# Altium schematic sheet RS485.SchDoc: Comunicación RS-485
size A4; Author: Agustin Zuliani; Revision: Rev: 00; SheetNumber: 2; SheetTotal: 7
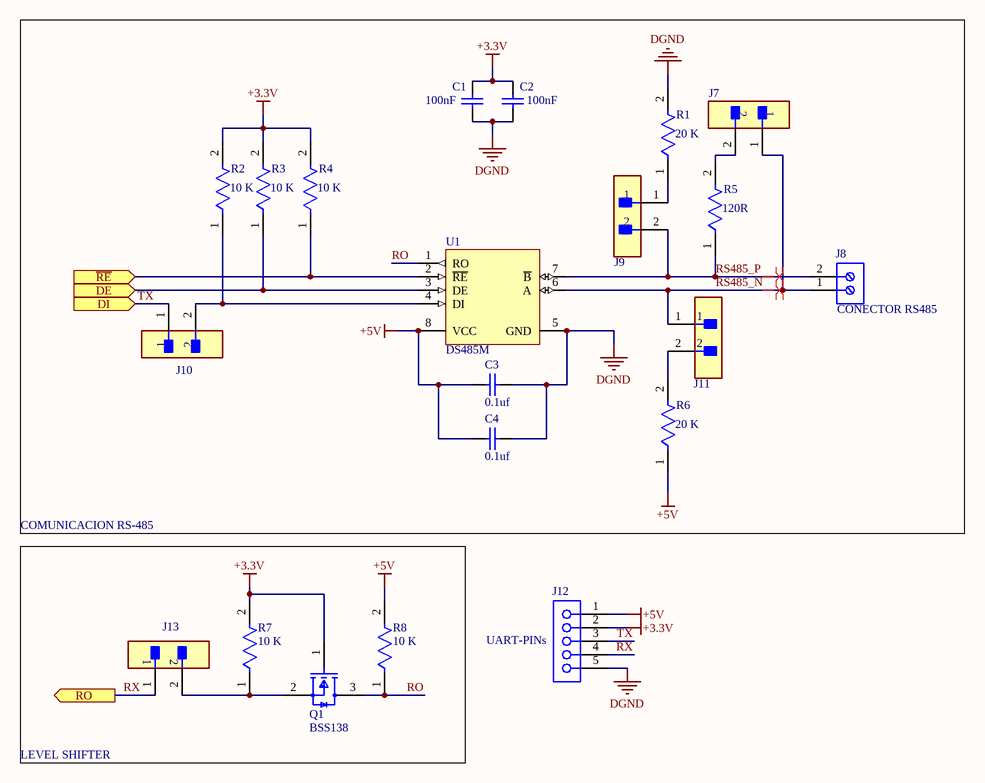
[diagram p0: RS485.SchDoc]

## Parts
C1  100nF  [CAPC2013X145X50LL20T25]
C2  100nF  [CAPC2013X145X50LL20T25]
C3  0.1uf  [CAPC2013X145X50NL20T25]
C4  0.1uf  [CAPC2013X145X50NL20T25]
J7  TSW-102-07-F-S  [FP-TSW-102-07-F-S-MFG]  (value not drawn)
J8  CONECTOR RS485  [691102710002]
J9  TSW-102-07-F-S  [FP-TSW-102-07-F-S-MFG]  (value not drawn)
J10  TSW-102-07-F-S  [FP-TSW-102-07-F-S-MFG]  (value not drawn)
J11  TSW-102-07-F-S  [FP-TSW-102-07-F-S-MFG]  (value not drawn)
J12  UART-PINs  [SMTC-ESQ-105-12-X-S]
J13  TSW-102-07-F-S  [FP-TSW-102-07-F-S-MFG]  (value not drawn)
Q1  BSS138  [FP-318-08-IPC_B]
R1  20 K  [FP-RN73R2A-IPC_A]
R2  10 K  [FP-RN73R2A-IPC_A]
R3  10 K  [FP-RN73R2A-IPC_A]
R4  10 K  [FP-RN73R2A-IPC_A]
R5  120R  [FP-RN73R2A-IPC_A]
R6  20 K  [FP-RN73R2A-IPC_A]
R7  10 K  [FP-AC0805-MFG]
R8  10 K  [FP-AC0805-MFG]
U1  DS485M  [D0008A_N]

## Blocks framed on the sheet
COMUNICACION RS-485: C1-C4 J7-J11 R1-R6 U1

## Ports
DE (in), DI (in), RO (out), ~{RE} (in)

## Nets
+3.3V: C1.1 C2.1 J12.2 Q1.1(G) R2.2 R3.2 R4.2 R7.2
+5V: C3.2 C4.2 J12.1 R6.1 R8.2 U1.8(VCC)
DGND: C1.2 C2.2 C3.1 C4.1 J12.5 R1.2 U1.5(GND)
DE: R3.1 U1.3(DE) ; port DE
~{RE}: R4.1 U1.2(~{RE}) ; port ~{RE}
RO: Q1.3(D) R8.1 U1.1(RO)
RS485_N: J7.1 J8.1 J11.1 U1.6(A)
RS485_P: J8.2 J9.2 R5.1 U1.7(~{B})
RX: J12.4 J13.1 ; port RO
TX: J10.1 J12.3 ; port DI
NetJ7_2: J7.2 R5.2
NetJ9_1: J9.1 R1.1
NetJ10_2: J10.2 R2.1 U1.4(DI)
NetJ11_2: J11.2 R6.2
NetJ13_2: J13.2 Q1.2(S) R7.1

## Layout directives
differential pair: RS485_N, RS485_P

## Notes on the sheet
- LEVEL SHIFTER

## Library data of the parts
C1 C2 = CMP-2007-01107-1: CAP 100nf 20% 0805; Manufacturer: Kemet; Part Number: C0805X104K3RACTU
C3 C4 = CMP-2007-01227-1: CAP 100nf 20% 0805; Manufacturer: Kemet; Part Number: C0805S104K5RACTU
J7 = CMP-02766-001458-1: HEADER 2 POS 2.54mm; Gender: Male; Max Current Rating: 7.6A; Number of Contacts: 2; Max Voltage Rating (AC): 550V; Orientation: Straight; Depth: 2.54mm; Series: TSW; Package Quantity: 1; Min Operating Temperature: -55°C; Max Operating Temperature: 125°C; Contact Type: Male Pin; Contact Shape: Square; Color: Black; Housing Color: Black; Connector Type: Header; Fastening Type: Pull; Radiation Hardening: No; Pitch: 2.54mm; Housing Material: Polyester; Mount: Through Hole; Number of Positions: 2; Number of Rows: 1; Contact Material: Bronze; Insulation Color: Black; Contact Finish - Mating: GOLD; Termination: Solder; Insulation Material: PBT; Length: 5.08mm; Flammability Rating: UL94 V-0; Contact Mating Length: 0.23inch; REACH SVHC: No SVHC; Contact Plating: Gold; RoHS Compliant: Yes; Packaging: Bulk
J8 = CMP-1502-03258-2: NexarPartId: 8917706; Number of Levels: 1; Number of Positions Per Level: 2; Current: 15A; Voltage: 300V; Pitch: 5.0038mm; Plating: Steel; Stripping Length: -6mm; Wire Gauge (Min): 14AWG; Wire Gauge (Max): 22AWG; Length: 7.5mm; Contact Material: Brass; Contact Plating: Tin; Packaging: Box; Number of Pins: 2; Voltage Rating: 300V; Termination: Screw; Number of Contacts: 2; Color: Blue; Current Rating: 15A; Mount: Through Hole; Max Operating Temperature: 105°C; Min Operating Temperature: -40°C; REACH SVHC: Unknown; Height: 13.4mm; Width: 11.2mm; Housing Material: Nylon; RoHS: Compliant; Wire/Cable Gauge: 22AWG; Lead Pitch: 5mm
J9 J11 = CMP-02766-001458-1: HEADER 2 POS 2.54mm / Habilitacion RES 20K; Gender: Male; Max Current Rating: 7.6A; Number of Contacts: 2; Max Voltage Rating (AC): 550V; Orientation: Straight; Depth: 2.54mm; Series: TSW; Package Quantity: 1; Min Operating Temperature: -55°C; Max Operating Temperature: 125°C; Contact Type: Male Pin; Contact Shape: Square; Color: Black; Housing Color: Black; Connector Type: Header; Fastening Type: Pull; Radiation Hardening: No; Pitch: 2.54mm; Housing Material: Polyester; Mount: Through Hole; Number of Positions: 2; Number of Rows: 1; Contact Material: Bronze; Insulation Color: Black; Contact Finish - Mating: GOLD; Termination: Solder; Insulation Material: PBT; Length: 5.08mm; Flammability Rating: UL94 V-0; Contact Mating Length: 0.23inch; REACH SVHC: No SVHC; Contact Plating: Gold; RoHS Compliant: Yes; Packaging: Bulk
J10 = CMP-02766-001458-1: HEADER 2 POS 2.54mm / Habilitacion TX; Gender: Male; Max Current Rating: 7.6A; Number of Contacts: 2; Max Voltage Rating (AC): 550V; Orientation: Straight; Depth: 2.54mm; Series: TSW; Package Quantity: 1; Min Operating Temperature: -55°C; Max Operating Temperature: 125°C; Contact Type: Male Pin; Contact Shape: Square; Color: Black; Housing Color: Black; Connector Type: Header; Fastening Type: Pull; Radiation Hardening: No; Pitch: 2.54mm; Housing Material: Polyester; Mount: Through Hole; Number of Positions: 2; Number of Rows: 1; Contact Material: Bronze; Insulation Color: Black; Contact Finish - Mating: GOLD; Termination: Solder; Insulation Material: PBT; Length: 5.08mm; Flammability Rating: UL94 V-0; Contact Mating Length: 0.23inch; REACH SVHC: No SVHC; Contact Plating: Gold; RoHS Compliant: Yes; Packaging: Bulk
J12 = CMP-1026-00012-1: HEADER PINS 5 WAY / Pines UART; Manufacturer: Samtec; PartNumber: ESQ-105-12-L-S; Pitch: 2.54 mm; PackageDescription: ESQ Strip ASM; Mounting Technology: Through-hole; DatasheetVersion: F-214; ComponentLink1URL: http://www.samtec.com; RoHS: True; ComponentLink3Description: Package Specification; ComponentLink2URL: http://www.samtec.com/documents/webfiles/pdf/ESQ_TH.PDF; ComponentLink3URL: http://www.samtec.com/documents/webfiles/cpdf/ESQ-1XX-XX-X-X-XXX-XX-X-XX-MKT.pdf; ComponentLink2Description: Datasheet; PackageVersion: BZ, 9/1998; Temperature Range: -55 to 125 degC; Orientation: Vertical; PackageReference: ESQ-105-12-X-S; ComponentLink1Description: Manufacturer URL
J13 = CMP-02766-001458-1: HEADER 2 POS 2.54mm / Habilitacion RX; Gender: Male; Max Current Rating: 7.6A; Number of Contacts: 2; Max Voltage Rating (AC): 550V; Orientation: Straight; Depth: 2.54mm; Series: TSW; Package Quantity: 1; Min Operating Temperature: -55°C; Max Operating Temperature: 125°C; Contact Type: Male Pin; Contact Shape: Square; Color: Black; Housing Color: Black; Connector Type: Header; Fastening Type: Pull; Radiation Hardening: No; Pitch: 2.54mm; Housing Material: Polyester; Mount: Through Hole; Number of Positions: 2; Number of Rows: 1; Contact Material: Bronze; Insulation Color: Black; Contact Finish - Mating: GOLD; Termination: Solder; Insulation Material: PBT; Length: 5.08mm; Flammability Rating: UL94 V-0; Contact Mating Length: 0.23inch; REACH SVHC: No SVHC; Contact Plating: Gold; RoHS Compliant: Yes; Packaging: Bulk
Q1 = CMP-07173-000101-1: MOSFET BSS138 SOT-23 / Level shifter RX; Turn-Off Delay Time: 20ns; Drain to Source Breakdown Voltage: 50V; Element Configuration: Single; Current Rating: 220mA; Rds On Max: 3.5R; Gate to Source Voltage (Vgs): 20V; Threshold Voltage: 1.3V; Number of Elements: 1; Power Dissipation: 360mW; Rise Time: 9ns; Turn-On Delay Time: 2.5ns; Input Capacitance: 27pF; On-State Resistance: 6R; Lead Free: Lead Free; Length: 2.92mm; Width: 1.3mm; Min Operating Temperature: -55°C; REACH SVHC: No SVHC; Packaging: Tape and Reel; Radiation Hardening: No; Height: 0.93mm; Drain to Source Voltage (Vdss): 50V; Voltage Rating (DC): 50V; Weight: 0.03g; Continuous Drain Current (ID): 220mA; Number of Pins: 3; Nominal Vgs: 1.3V; Max Power Dissipation: 360mW; Fall Time: 9ns; Drain to Source Resistance: 3.5R; Contact Plating: Tin; Case/Package: SOT-23; Package Quantity: 1; Dual Supply Voltage: 50V; Mount: Surface Mount; Termination: SMD/SMT; Max Operating Temperature: 150°C
R1 R6 = CMP-04015-052084-1: RES 20K 5% 0805
R2-R4 = CMP-04015-052084-1: RES 10K 5% 0805
R5 = CMP-04015-052084-1: RES 120R 5% 0805 / Resistencia de terminacion
R7 R8 = CMP-2001-04494-2: RES 10K 5% 0805; Manufacturer Part Number: AC0805FR-072K2L; Manufacturer: Yageo; Value: 2.2KΩ; Automotive Grade: Grade 0; Voltage Rating: 150V; Tolerance: 0.01; Power Rating: 1/8W; Series: AC; Category: Res; Device Class L1: Passive Components; Digikey Description: RES SMD 2.2K OHM 1% 1/8W 0805; Mouser Description: Thick Film Resistors - SMD 1/8W 2.2K ohm 1% AEC-Q200; ComponentLink2Description: Datasheet; Composition: Thick Film; Height: 0.6mm; Temperature Range High: +155°C; Temperature Range Low: -55°C; Package: AC0805; Temperature: -55°C to +155°C; RoHS: TRUE; Ipc Land Pattern Name: RESC200125X50; Footprint Url: http://www.yageo.com/exep/pages/download/literatures/PYu-R_Mount_10.pdf; ComponentLink2URL: http://www.yageo.com/documents/recent/PYu-AC_51_RoHS_L_6.pdf; Resistance: 2.2KΩ; Automotive: Yes; Device Class L2: Resistors; Device Class L3: Chip SMD Resistors; Octopart: https://octopart.com/ac0805fr-072k2l-yageo-26041153; Lead Free: Yes
U1 = CMP-0058-00811-3: CI MAX485; Manufacturer: Texas Instruments; PackageTopMarking: NSZXTT*DS485*M; CompType: Interface IC; PowerWise: N; ComponentLink1URL: http://www.ti.com/general/docs/lit/getliterature.tsp?genericPartNumber=DS485&fileType=pdf; PackageReference: D0008A; ComponentLink1Description: Datasheet URL; Code_IPC: SOIC127P600-8; PinCount: 8; Code_JEDEC: MS-012-AA; RoHS: N; PackageDescription: SOIC Narrow, 4.9 x 3.9 x 1.45mm, 8 Lead, 1.27mm Pitch